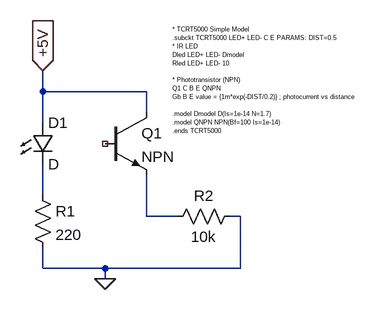
[diagram p0: schematic TCRT5000.asc]
TCRT5000.asc, the LTspice schematic file:
Version 4
SHEET 1 880 680
WIRE 160 64 160 32
WIRE 320 64 160 64
WIRE 320 96 320 64
WIRE 160 112 160 64
WIRE 160 224 160 176
WIRE 320 256 320 192
WIRE 368 256 320 256
WIRE 464 256 448 256
WIRE 160 336 160 304
WIRE 256 336 160 336
WIRE 464 336 464 256
WIRE 464 336 256 336
WIRE 256 352 256 336
FLAG 160 32 +5V
IOPIN 160 32 In
FLAG 256 352 0
SYMBOL LED 144 112 R0
SYMATTR InstName D1
SYMBOL res 144 208 R0
SYMATTR InstName R1
SYMATTR Value 220
SYMBOL npn 256 96 R0
SYMATTR InstName Q1
SYMBOL res 464 240 R90
WINDOW 0 0 56 VBottom 2
WINDOW 3 32 56 VTop 2
SYMATTR InstName R2
SYMATTR Value 10k
TEXT 360 -32 Left 0 !* TCRT5000 Simple Model\n.subckt TCRT5000 LED+ LED- C E PARAMS: DIST=0.5\n* IR LED\nDled LED+ LED- Dmodel\nRled LED+ LED- 10\n \n* Phototransistor (NPN)\nQ1 C B E QNPN\nGb B E value = {1m*exp(-DIST/0.2)} ; photocurrent vs distance\n \n.model Dmodel D(Is=1e-14 N=1.7)\n.model QNPN NPN(Bf=100 Is=1e-14)\n.ends TCRT5000

The netlist it stands for:
* TCRT5000.asc
D1 +5V N001 D
R1 N001 0 220
Q1 +5V NC_01 N002 0 NPN
R2 0 N002 10k
.model D D
.lib standard.dio
.model NPN NPN
.model PNP PNP
.lib standard.bjt
* TCRT5000 Simple Model
.subckt TCRT5000 LED+ LED- C E PARAMS: DIST=0.5
* IR LED
Dled LED+ LED- Dmodel
Rled LED+ LED- 10
* Phototransistor (NPN)
Q1 C B E QNPN
Gb B E value = {1m*exp(-DIST/0.2)} ; photocurrent vs distance
.model Dmodel D(Is=1e-14 N=1.7)
.model QNPN NPN(Bf=100 Is=1e-14)
.ends TCRT5000
.backanno
.end